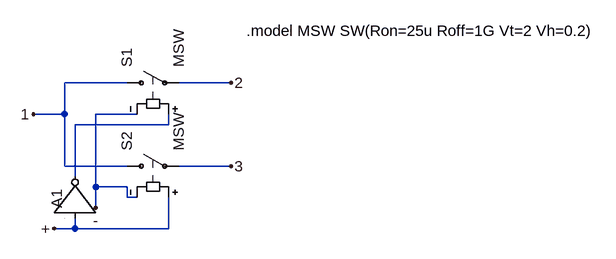
[diagram p0: schematic SPDT.asc]
SPDT.asc, the LTspice schematic file:
Version 4
SHEET 1 932 680
WIRE 144 96 48 96
WIRE 304 96 224 96
WIRE 48 144 48 96
WIRE 48 144 0 144
WIRE 160 144 96 144
WIRE 208 160 208 144
WIRE 208 160 64 160
WIRE 48 224 48 144
WIRE 144 224 48 224
WIRE 304 224 224 224
WIRE 64 240 64 160
WIRE 96 256 96 144
WIRE 144 256 96 256
WIRE 144 272 144 256
WIRE 160 272 144 272
WIRE 96 288 96 256
WIRE 64 320 64 304
WIRE 64 320 32 320
WIRE 208 320 208 272
WIRE 208 320 64 320
FLAG 0 144 1
FLAG 304 96 2
FLAG 304 224 3
FLAG 32 320 +
FLAG 96 288 -
SYMBOL sw 128 96 R270
SYMATTR InstName S1
SYMATTR Value MSW
SYMBOL sw 128 224 R270
SYMATTR InstName S2
SYMATTR Value MSW
SYMBOL Digital\\inv 128 304 M270
WINDOW 3 8 60 Invisible 2
WINDOW 0 15 92 Left 2
SYMATTR Value td=10n Vhigh=5
SYMATTR InstName A1
TEXT 328 16 Left 2 !.model MSW SW(Ron=25u Roff=1G Vt=2 Vh=0.2)

The netlist it stands for:
* SPDT.asc
S1 1 2 N001 - MSW
S2 1 3 + - MSW
A1 + 0 0 0 0 N001 0 0 BUF td=10n Vhigh=5
.model MSW SW(Ron=25u Roff=1G Vt=2 Vh=0.2)
.backanno
.end